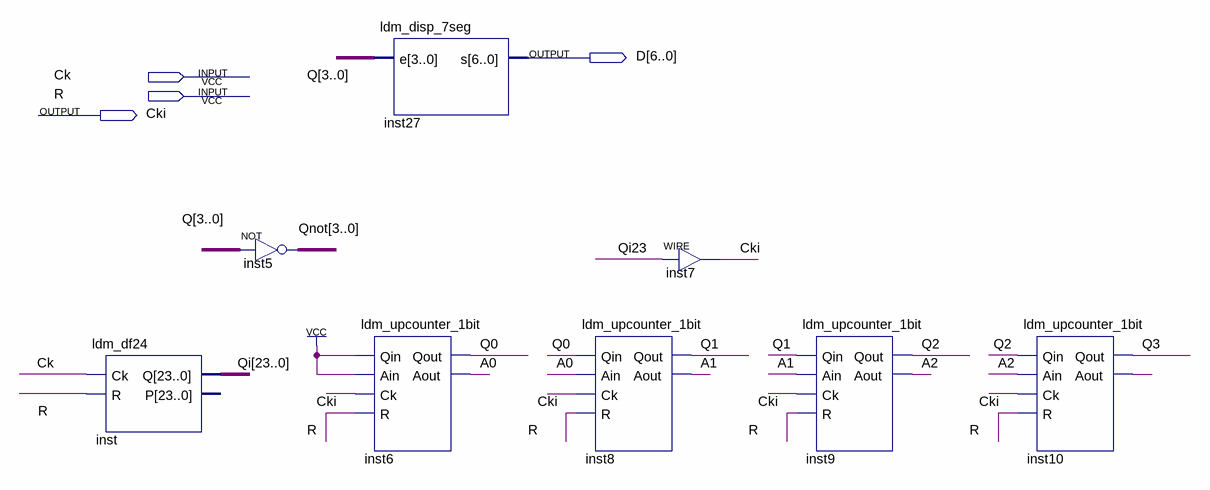
[diagram p0: schematic sheet]
// Quartus schematic ldm_df24disp.bdf as structural Verilog: 8 symbols, 4 pins
module ldm_df24disp (
  input  Ck,
  input  R,
  output [6:0] D,
  output Cki
);

  wire A0, A1, A2, inst10_aout;
  wire [3:0] Q, Qnot;
  wire [23:0] Qi;

  ldm_df24 inst (.Ck(Ck), .R(R), .Q(Qi));  // open: P
  assign Qnot = ~Q;  // NOT inst5, 4 bits wide
  ldm_disp_7seg inst27 (.e(Q), .s(D));
  ldm_upcounter_1bit inst6 (.Qin(1'b1), .Ain(1'b1), .Ck(Cki), .R(R), .Qout(Q[0]), .Aout(A0));
  ldm_upcounter_1bit inst8 (.Qin(Q[0]), .Ain(A0), .Ck(Cki), .R(R), .Qout(Q[1]), .Aout(A1));
  assign Cki = Qi[23];  // WIRE inst7
  ldm_upcounter_1bit inst9 (.Qin(Q[1]), .Ain(A1), .Ck(Cki), .R(R), .Qout(Q[2]), .Aout(A2));
  ldm_upcounter_1bit inst10 (.Qin(Q[2]), .Ain(A2), .Ck(Cki), .R(R), .Qout(Q[3]), .Aout(inst10_aout));
endmodule
